# Altium schematic sheet amplifier.SchDoc
size A4
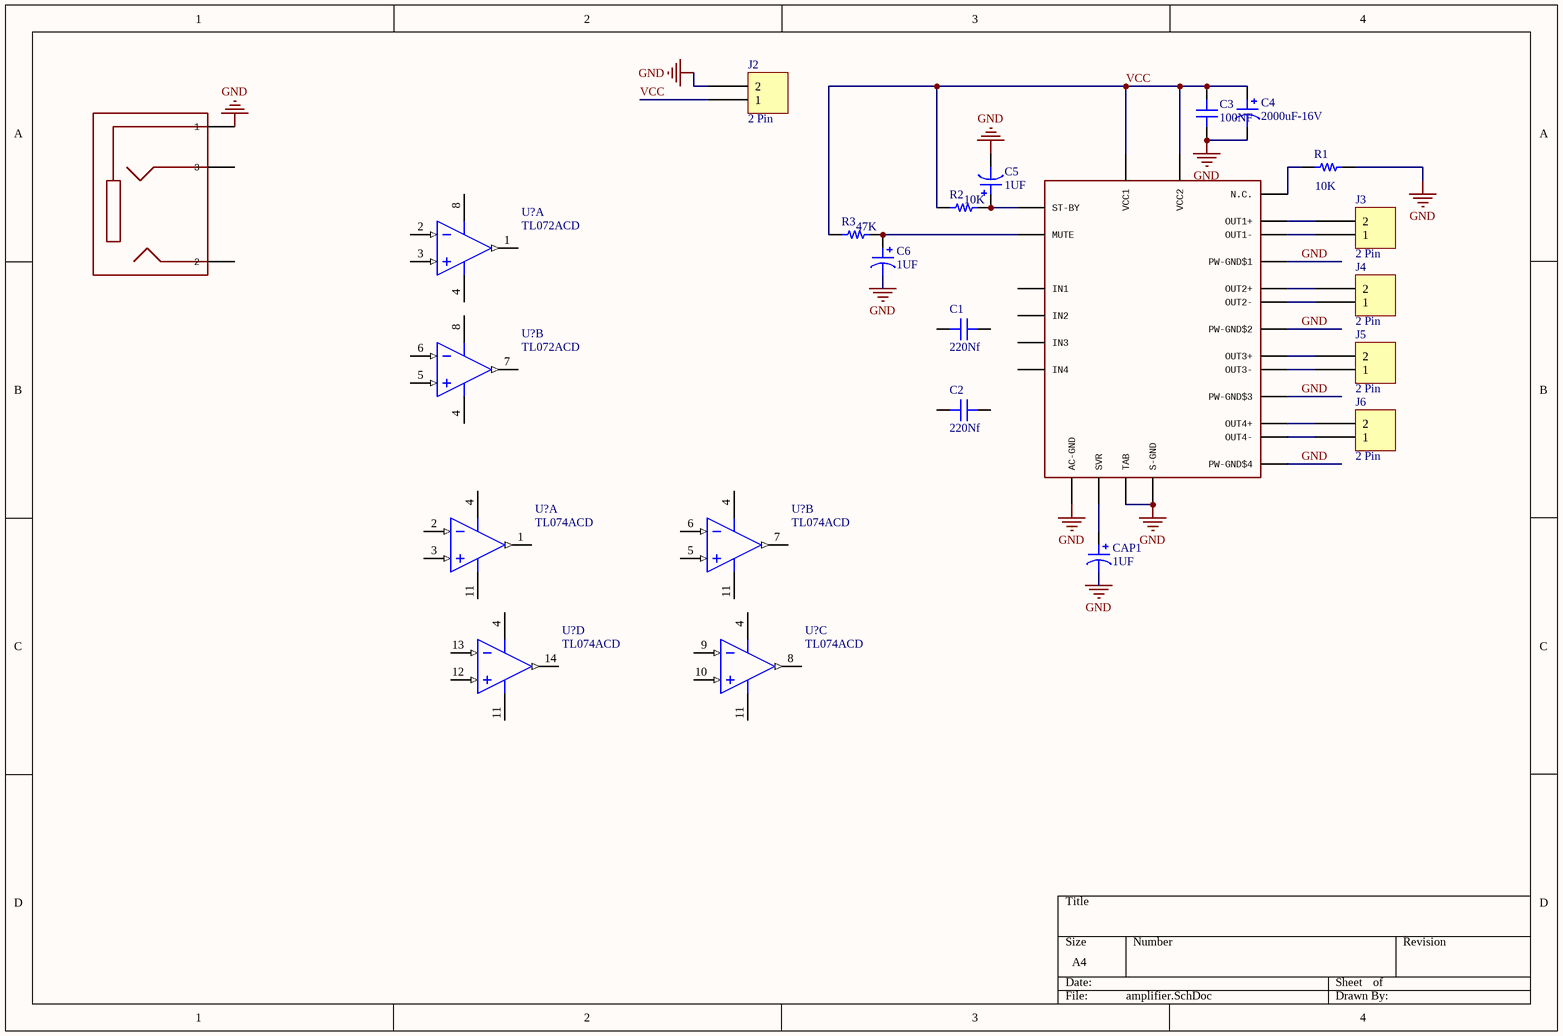
[diagram p0: amplifier.SchDoc]

## Parts
(Parts that share a designator on the sheet are numbered #1, #2 ... from top to bottom, then left to right.)
1  TDA7850  [FLEXIWATT25]  (value not drawn)
?  3.5 mm Right-Angle Stereo Jack, 4 Pin PCB Mount, Isolated Ground  [3.5mm jack]  (value not drawn)
C1  220Nf  [CAP 1206/3216]
C2  220Nf  [CAP 1206/3216]
C3  100NF  [CAP 1206/3216]
C4  2000uF-16V  [Cap_5_(7.5mm)]
C5  1UF  [CAP ALUM 6.6MM]
C6  1UF  [CAP ALUM 6.6MM]
CAP1  1UF  [CAP ALUM 6.6MM]
J2  2 Pin  [Socket_Blue_2]
J3  2 Pin  [Socket_Blue_2]
J4  2 Pin  [Socket_Blue_2]
J5  2 Pin  [Socket_Blue_2]
J6  2 Pin  [Socket_Blue_2]
R1  10K  [RES 1206/3216]
R2  10K  [RES 1206/3216]
R3  47K  [RES 1206/3216]
U?#1  TL072ACD  [TI-D8_L]  (part A of 2)
U?#2  TL072ACD  [TI-D8_N]  (part B of 2)
U?#3  TL074ACD  [TI-D14_L]  (part A of 4)
U?#4  TL074ACD  [TI-D14_N]  (part B of 4)
U?#5  TL074ACD  [TI-D14_N]  (part D of 4)
U?#6  TL074ACD  [TI-D14_N]  (part C of 4)

## Nets
GND: 1.P$1(TAB) 1.P$2(PW-GND$2) 1.P$8(PW-GND$1) 1.P$13(S-GND) 1.P$16(AC-GND) 1.P$18(PW-GND$3) 1.P$24(PW-GND$4) ?.1 C3.1 C4.2 C5.2 C6.2 CAP1.2 J2.2 R1.2
VCC: 1.P$6(VCC1) 1.P$20(VCC2) C3.2 C4.1 J2.1 R2.1 R3.1
Net1_P$3: 1.P$3(OUT2-) J4.1
Net1_P$4: 1.P$4(ST-BY) C5.1 R2.2
Net1_P$5: 1.P$5(OUT2+) J4.2
Net1_P$7: 1.P$7(OUT1-) J3.1
Net1_P$9: 1.P$9(OUT1+) J3.2
Net1_P$10: 1.P$10(SVR) CAP1.1
Net1_P$17: 1.P$17(OUT3+) J5.2
Net1_P$19: 1.P$19(OUT3-) J5.1
Net1_P$21: 1.P$21(OUT4+) J6.2
Net1_P$22: 1.P$22(MUTE) C6.1 R3.2
Net1_P$23: 1.P$23(OUT4-) J6.1
Net1_P$25: 1.P$25(N.C.) R1.1

Not connected (* = marked no-connect by the designer): 1 P$11(IN1) P$12(IN2) P$14(IN4) P$15(IN3); ? 2 3; C1 1 2; C2 1 2; U?#1 1(OUT1) 2(IN1-) 3(IN1+) 4(VCC-) 8(VCC+); U?#2 4(VCC-) 5(IN2+) 6(IN2-) 7(OUT2) 8(VCC+); U?#3 1(OUT1) 2(IN1-) 3(IN1+) 4(VCC+) 11(VCC-); U?#4 4(VCC+) 5(IN2+) 6(IN2-) 7(OUT2) 11(VCC-); U?#5 4(VCC+) 11(VCC-) 12(IN4+) 13(IN4-) 14(OUT4); U?#6 4(VCC+) 8(OUT3) 9(IN3-) 10(IN3+) 11(VCC-)

## Library data of the parts
1 = TDA7850: GateName_1: G$1; SymbolName_1: TDA7386; LibraryName: Audio-Power-amlifier; DeviceSetName: TDA7386; Package: FLEXIWATT25
? = 3.5mm Jack: GateName_1: G$1; SymbolName_1: SJ1-3524NG; MF: CUI; LibraryName: SJ1-3524NG; DeviceSetName: SJ1-3524NG; Package: PIN-4; Price: 0.55 USD; Package: None; MP: SJ1-3524NG; Availability: Good
C1-C3 = Capacitor: SMT Capacitor; Value: 0.1uF
C4-C6 CAP1 = Polarised Capacitor: SMT Polarised Capacitor; Value: 10uF
R1-R3 = Resistor: SMT Resistor; Value: 1K
U?#1 U?#2 = TL072ACD: Low-Noise JFET-Input Operational Amplifier, 7 to 36 V, 0 to 70 degC, 8-pin SOIC (D8), Green (RoHS & no Sb/Br); Manufacturer: Texas Instruments; CMRR(Min)(dB): 75; GBW(Typ)(MHz): 3; IIB(Max)(pA): 200; Iq per channel(Max)(mA): 2.5; Number of Channels: 2; Offset Drift(Typ)(uV/C): 18; Rating: Catalog; Slew Rate(Typ)(V/us): 13; Sub Family: General Purpose Amplifier, High Supply Voltage Amplifier (>=30V); Total Supply Voltage(Max)(+5V is 5, +/-5V is 10): 36; Total Supply Voltage(Min)(+5V is 5, +/-5V is 10): 7; Vio (25C)(Max)(mV): 6; DatasheetVersion: SLOS080J; PackageVersion: 4040047-3/M, 06/2011; PackageReference: D8; PackageDescription: 8-Pin Plastic Small Outline, Body 4.9 x 3.9 mm, Pitch 1.27 mm; Supplier 1: Digi-Key; Supplier Part Number 1: 296-7189-5-ND; Supplier 2: Farnell; Supplier Part Number 2: 9593322; Supplier 3: Newark; Supplier Part Number 3: 35K1256; Supplier 4: Mouser; Supplier Part Number 4: 595-TL072ACD; Eco-Plan: Green (RoHS & no Sb/Br); Vn at 1kHz(Typ)(nV/rtHz): 18; Mounting Technology: Surface Mount; Code_JEDEC: MS-012; PartNumber: TL072ACD; ComponentLink1Description: Manufacturer URL; ComponentLink1URL: http://www.ti.com/; ComponentLink2Description: Datasheet; ComponentLink2URL: http://www.ti.com/lit/ds/symlink/tl072a.pdf; ComponentLink3Description: Package Specification; ComponentLink3URL: http://www.ti.com/litv/pdf/msoi002j
U?#3-U?#6 = TL074ACD: Low-Noise JFET-Input Operational Amplifier, 7 to 36 V, 0 to 70 degC, 14-pin SOIC (D14), Green (RoHS & no Sb/Br); Manufacturer: Texas Instruments; CMRR(Min)(dB): 75; GBW(Typ)(MHz): 3; IIB(Max)(pA): 200; Iq per channel(Max)(mA): 2.5; Number of Channels: 4; Offset Drift(Typ)(uV/C): 18; Rating: Catalog; Slew Rate(Typ)(V/us): 13; Sub Family: General Purpose Amplifier, High Supply Voltage Amplifier (>=30V); Total Supply Voltage(Max)(+5V is 5, +/-5V is 10): 36; Total Supply Voltage(Min)(+5V is 5, +/-5V is 10): 7; Vio (25C)(Max)(mV): 6; DatasheetVersion: SLOS080J; PackageVersion: 4040047-5/M, 06/2011; PackageReference: D14; PackageDescription: 14-Pin Plastic Small Outline, Body 8.65 x 3.90 mm, Pitch 1.27 mm; Supplier 1: Digi-Key; Supplier Part Number 1: 296-7195-5-ND; Supplier 2: Farnell; Supplier Part Number 2: 9593349; Supplier 3: Newark; Supplier Part Number 3: 52F2748; Supplier 4: Mouser; Supplier Part Number 4: 595-TL074ACD; Eco-Plan: Green (RoHS & no Sb/Br); Vn at 1kHz(Typ)(nV/rtHz): 18; Mounting Technology: Surface Mount; Code_JEDEC: MS-012; PartNumber: TL074ACD; ComponentLink1Description: Manufacturer URL; ComponentLink1URL: http://www.ti.com/; ComponentLink2Description: Datasheet; ComponentLink2URL: http://www.ti.com/lit/ds/symlink/tl074a.pdf; ComponentLink3Description: Package Specification; ComponentLink3URL: http://www.ti.com/lit/ml/mpds177g/mpds177g.pdf